# Altium schematic sheet Dogfish3D - Endstop Channel.SchDoc
size A
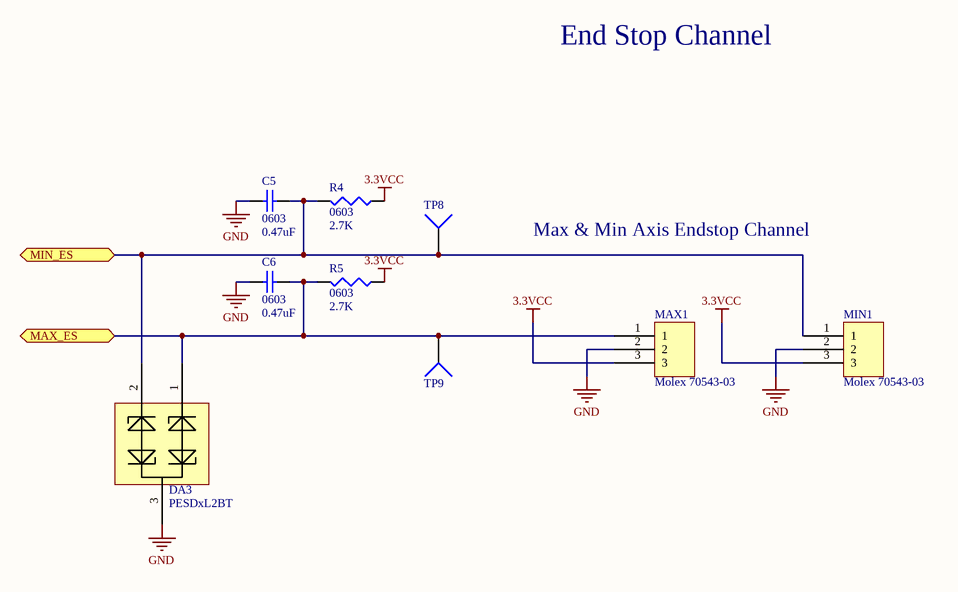
[diagram p0: Dogfish3D - Endstop Channel.SchDoc]

## Parts
C5  0603  value 0.47uF  [1608[0603]]
C6  0603  value 0.47uF  [1608[0603]]
DA3  PESDxL2BT  [SOT95P230X110-3N]
MAX1  Molex 70543-03  [70543-03]
MIN1  Molex 70543-03  [70543-03]
R4  0603  value 2.7K  [J1-0603]
R5  0603  value 2.7K  [J1-0603]
TP8  TP4  [TP-2]  (value not drawn)
TP9  TP4  [TP-2]  (value not drawn)

## Ports
MAX_ES, MIN_ES

## Nets
3.3VCC: MAX1.3 MIN1.3 R4.1 R5.1
GND: C5.2 C6.2 DA3.3 MAX1.2 MIN1.2
MAX_ES: C6.1 DA3.1 MAX1.1 R5.2 TP9.1 ; port MAX_ES
MIN_ES: C5.1 DA3.2 MIN1.1 R4.2 TP8.1 ; port MIN_ES

## Notes on the sheet
- End Stop Channel
- Max & Min Axis Endstop Channel

## Library data of the parts
C5 C6 = Cap Semi: Capacitor (Semiconductor SIM Model); Published: 8-Jun-2000; LatestRevisionDate: 29-May-2009; LatestRevisionNote: IPC-7351 Footprint Added.; PackageReference: C1206; Publisher: Altium Limited; PackageDescription: Chip Capacitor
DA3 = PESDxL2BT: PESDxL2BT TVS Diode Array 2x
MAX1 MIN1 = Molex Endstop
R4 R5 = Res3: Resistor; Published: 8-Jun-2000; LatestRevisionDate: 29-May-2009; LatestRevisionNote: IPC-7351 Footprint Added.; PackageReference: J1-0603; Publisher: Altium Limited; PackageDescription: Chip Resistor
TP8 TP9 = Socket: LatestRevisionDate: 17-Jul-2002; LatestRevisionNote: Re-released for DXP Platform.; Publisher: Altium Limited